# EAGLE schematic main (EAGLE 9.6.2)
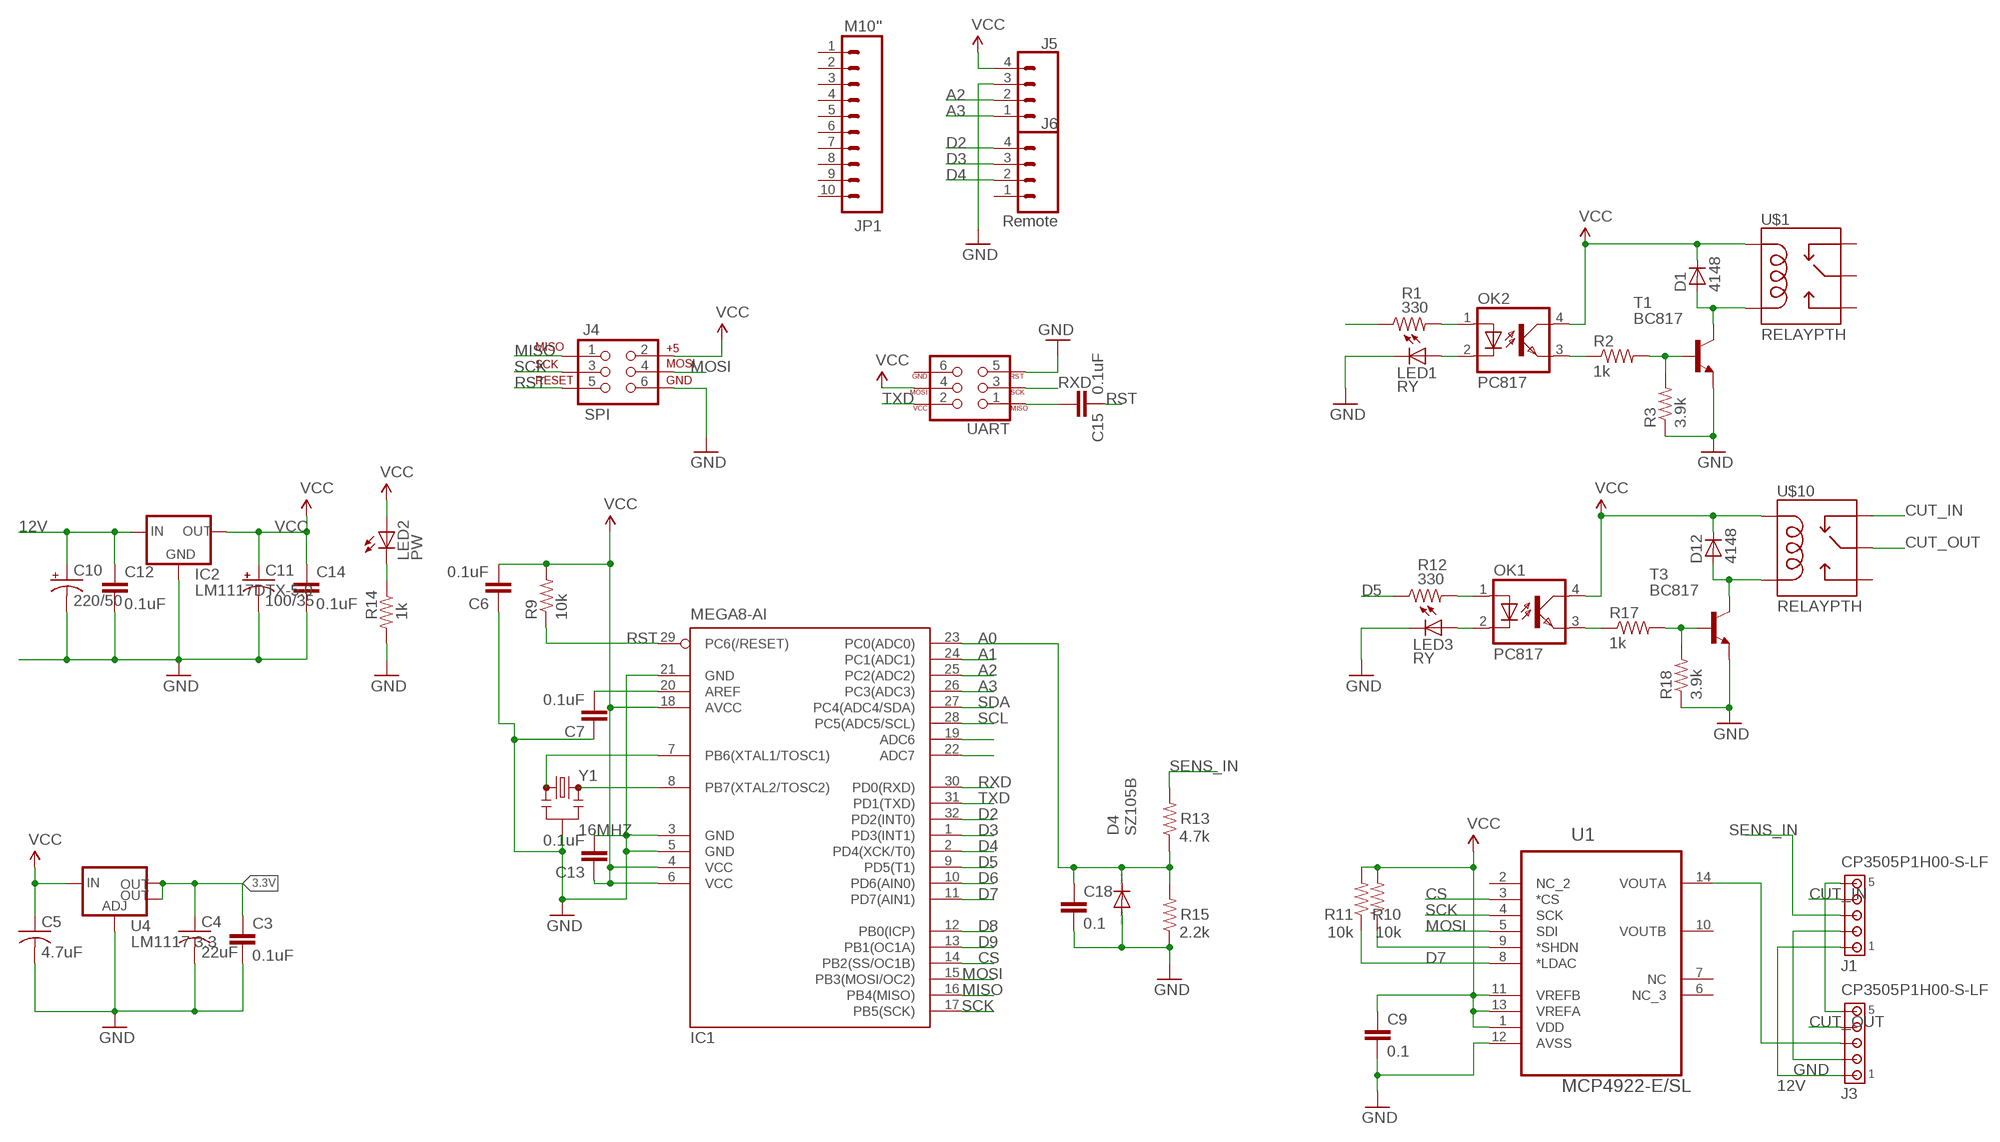
[diagram p0: schematic, sheet 1]

## Parts
C3  0.1uF  CAP0805  [0805]
C4  22uF  C-USC1206  [C1206]
C5  4.7uF  C-USC1206  [C1206]
C6  0.1uF  CAP0805  [0805]
C7  0.1uF  CAP0805  [0805]
C9  0.1  CAP0805  [0805]
C10  220/50  CPOL-US153CLV-1010  [153CLV-1010]
C11  100/35  CPOL-US153CLV-0605  [153CLV-0605]
C12  0.1uF  CAP0805  [0805]
C13  0.1uF  CAP0805  [0805]
C14  0.1uF  CAP0805  [0805]
C15  0.1uF  CAP0805  [0805]
C18  0.1  CAP0805  [0805]
D1  4148  D-SOD-80  [SOD80]
D4  SZ105B  DIODE-DO-214AC  [DO-214AC]
D12  4148  D-SOD-80  [SOD80]
IC1  MEGA8-AI  [TQFP32-08]
IC2  LM1117DTX-5.0  LM1117DTX-3.3  [TO252]
J1  CP3505P1H00-S-LF  1445055-5  [1445055-5]
J3  CP3505P1H00-S-LF  1445055-5  [1445055-5]
J4  SPI  AVR_SPI_PRG_6PTH  [2X3]
J5  CONN_04JST-PTH  [JST-4-PTH]
J6  Remote  CONN_04JST-PTH  [JST-4-PTH]
JP1  M10"  [1X10]
LED1  RY  LED3MM  [LED3MM]
LED2  PW  LED3MM  [LED3MM]
LED3  RY  LED3MM  [LED3MM]
OK1  PC817  LTV816S  [DIL4-SMD]
OK2  PC817  LTV816S  [DIL4-SMD]
R1  330  RESISTOR0805-RES  [0805]
R2  1k  RESISTOR0805-RES  [0805]
R3  3.9k  RESISTOR0805-RES  [0805]
R9  10k  RESISTOR0805-RES  [0805]
R10  10k  RESISTOR0805-RES  [0805]
R11  10k  RESISTOR0805-RES  [0805]
R12  330  RESISTOR0805-RES  [0805]
R13  4.7k  RESISTOR0805-RES  [0805]
R14  1k  RESISTOR0805-RES  [0805]
R15  2.2k  RESISTOR0805-RES  [0805]
R17  1k  RESISTOR0805-RES  [0805]
R18  3.9k  RESISTOR0805-RES  [0805]
T1  BC817  BC817-16-NPN-SOT23-BEC  [SOT23-BEC]
T3  BC817  BC817-16-NPN-SOT23-BEC  [SOT23-BEC]
U1  MCP4922-E/SL  [SOIC127P600X175-14N]
U4  LM1117 3.3  V_REG_LM1117SOT223  [SOT223]
U$1  RELAYPTH  [SRD-05VDC-SL-C]
U$10  RELAYPTH  [SRD-05VDC-SL-C]
UART  AVR_SPI_PROG_3X2TESTPOINTS  [2X3_TEST_POINTS]
Y1  16MHZ  RESONATOR16MHZ  [RESONATOR-SMD]

## Nets
3.3V: C3.1 C4.1 U4.2(OUT) U4.4(OUT)
12V: C10.+ C12.1 IC2.2(IN) J1.1 J3.1
A0: C18.1 D4.C IC1.23(PC0(ADC0)) R13.1 R15.2
A1: IC1.24(PC1(ADC1))
A2: IC1.25(PC2(ADC2)) J5.2
A3: IC1.26(PC3(ADC3)) J5.1
CS: IC1.14(PB2(SS/OC1B)) U1.3(*CS)
CUT_IN: J1.4 U$10.SWCLOSED(SWCLOSE)
CUT_OUT: J3.4 U$10.SWCOMMON
D2: IC1.32(PD2(INT0)) J6.4
D3: IC1.1(PD3(INT1)) J6.3
D4: IC1.2(PD4(XCK/T0)) J6.2
D5: IC1.9(PD5(T1)) R1.1 R12.1
D6: IC1.10(PD6(AIN0))
D7: IC1.11(PD7(AIN1)) R11.1 U1.8(*LDAC)
D8: IC1.12(PB0(ICP))
D9: IC1.13(PB1(OC1A))
GND: C3.2 C4.2 C5.2 C6.1 C7.1 C9.2 C10.- C11.- C12.2 C13.2 C14.2 C18.2 D4.A IC1.3(GND) IC1.5(GND) IC1.21(GND) IC2.1(GND) J1.2 J3.2 J4.6 J5.3 LED1.K(C) LED3.K(C) R3.1 R14.2 R15.1 R18.1 T1.E T3.E U1.12(AVSS) U4.1(ADJ) UART.5 Y1.2
MISO: IC1.16(PB4(MISO)) J4.1
MOSI: IC1.15(PB3(MOSI/OC2)) J4.4 U1.5(SDI)
N$1: IC1.19(ADC6)
N$2: IC1.22(ADC7)
N$3: OK2.3(EMIT) R2.1
N$4: R2.2 R3.2 T1.B
N$5: IC1.8(PB7(XTAL2/TOSC2)) Y1.3
N$6: D1.2(A) T1.C U$1.COIL0
N$7: IC1.7(PB6(XTAL1/TOSC1)) Y1.1
N$8: C7.2 IC1.20(AREF)
N$9: OK2.1(A) R1.2
N$10: LED1.A OK2.2(C)
N$12: LED2.K(C) R14.1
N$13: J3.3 U1.14(VOUTA)
N$14: J1.5 J3.5
N$16: R10.1 U1.9(*SHDN)
N$18: C15.1 UART.1
N$20: OK1.3(EMIT) R17.1
N$21: R17.2 R18.2 T3.B
N$22: D12.2(A) T3.C U$10.COIL0
N$23: OK1.1(A) R12.2
N$31: LED3.A OK1.2(C)
RST: C15.2 IC1.29(PC6(/RESET)) J4.5 R9.1
RXD: IC1.30(PD0(RXD)) UART.3
SCK: IC1.17(PB5(SCK)) J4.3 U1.4(SCK)
SCL: IC1.28(PC5(ADC5/SCL))
SDA: IC1.27(PC4(ADC4/SDA))
SENS_IN: J1.3 R13.2
TXD: IC1.31(PD1(TXD)) UART.2
VCC: C5.1 C6.2 C9.1 C11.+ C13.1 C14.1 D1.1(C) D12.1(C) IC1.4(VCC) IC1.6(VCC) IC1.18(AVCC) IC2.TAB(OUT) J4.2 J5.4 LED2.A OK1.4(COL) OK2.4(COL) R9.2 R10.2 R11.2 U1.1(VDD) U1.11(VREFB) U1.13(VREFA) U4.3(IN) U$1.COIL1 U$10.COIL1 UART.4
Unconnected: J6.1 JP1.1 JP1.2 JP1.3 JP1.4 JP1.5 JP1.6 JP1.7 JP1.8 JP1.9 JP1.10 U1.2(NC_2) U1.6(NC_3) U1.7(NC) U1.10(VOUTB) U$1.SWCLOSED(SWCLOSE) U$1.SWCOMMON U$1.SWOPEN U$10.SWOPEN UART.6

## Library data of the parts
C3 C6 C7 C9 C12-C15 C18 = SparkFun-Passives:CAP: Capacitor Standard 0603 ceramic capacitor, and 0.1" leaded capacitor.
C4 C5 = adafruit:C-US: CAPACITOR, American symbol
C10 C11 = adafruit:CPOL-US: POLARIZED CAPACITOR, American symbol
D1 D12 = semicon-smd-ipc:D-: DIODE unfilled
D4 = diode:DIODE-: DIODE
IC1 = atmel:MEGA8: MICROCONTROLLER 8 Kbytes FLASH, 1 kbytes SRAM, 512 bytes EEPROM, USART, 6-channel 10 bit ADC, 2-channel 8 bit ADC Pin compatible with Atmega48, ATMega88, ATMega168 Source: avr.lbr; MPN: ATMEGA8-16AU; OC_FARNELL: 9171371; OC_NEWARK: 73M8863
IC2 = lm1117:LM1117DTX-*
J1 J3 = con-amp:1445055-5: Micro MATE-N-LOK Connectors grid 1.5 mm Source: ENG_CD_1445055_A.pdf
J4 = SparkFun-Connectors:AVR_SPI_PRG_6: AVR ISP 6 Pin This is the reduced ISP connector for AVR programming. Common on Arduino. This footprint will take up less PCB space and can be used with a 10-pin to 6-pin adapter such as SKU: BOB-08508 **Special note about "TEST_POINT" package. The stop mask is on the top side, so if you want your programming test points to be on the bottom of your board, make sure to place this package on the bottom side of the board. This also ensure that the orientation to program from the bottom side will be correct.
J5 J6 = SparkFun-Connectors:CONN_04: Multi connection point. Often used as Generic Header-pin footprint for 0.1 inch spaced/style header connections On any of the 0.1 inch spaced packages, you can populate with these: Break Away Headers - Straight <https://www.sparkfun.com/products/116> (PRT-00116) Break Away Male Headers - Right Angle <https://www.sparkfun.com/products/553> (PRT-00553) Female Headers <https://www.sparkfun.com/products/115> (PRT-00115) Break Away Headers - Machine Pin <https://www.sparkfun.com/products/117> (PRT-00117) Break Away Female Headers - Swiss Machine Pin <https://www.sparkfun.com/products/743> (PRT-00743) For SCREWTERMINALS and SPRING TERMINALS visit here: Screw Terimnals on SparkFun.com <https://www.sparkfun.com/search/results?term=Screw+Terminals> (5mm/3.5mm/2.54mm spacing) This device is also useful as a general connection point to wire up your design to another part of your project. Our various solder wires solder well into these plated through hole pads. Hook-Up Wire - Assortment (Stranded, 22 AWG) <https://www.sparkfun.com/products/11375> (PRT-11375) Hook-Up Wire - Assortment (Solid Core, 22 AWG) <https://www.sparkfun.com/products/11367> (PRT-11367) View the entire wire category on our website here <https://www.sparkfun.com/categories/141> Special notes: Molex polarized connector foot print use with SKU : PRT-08231 with associated crimp pins and housings. 1MM SMD Version SKU: PRT-10208; PROD_ID: WIRE-13531; SF_ID: PRT-09916
JP1 = SparkFun-Connectors:M10: Header 10 Standard 10-pin 0.1" header. Use with straight break away headers (SKU : PRT-00116), right angle break away headers (PRT-00553), swiss pins (PRT-00743), machine pins (PRT-00117), and female headers (PRT-00115).
LED1-LED3 = adafruit:LED: LED OSRAM: - CHIPLED LG R971, LG N971, LY N971, LG Q971, LY Q971, LO R971, LY R971 LH N974, LH R974 LS Q976, LO Q976, LY Q976 LO Q996 - Hyper CHIPLED LW Q18S LB Q993, LB Q99A, LB R99A - SideLED LS A670, LO A670, LY A670, LG A670, LP A670 LB A673, LV A673, LT A673, LW A673 LH A674 LY A675 LS A676, LA A676, LO A676, LY A676, LW A676 LS A679, LY A679, LG A679 - Hyper Micro SIDELED® LS Y876, LA Y876, LO Y876, LY Y876 LT Y87S - SmartLED LW L88C, LW L88S LB L89C, LB L89S, LG L890 LS L89K, LO L89K, LY L89K LS L896, LA L896, LO L896, LY L896 - TOPLED LS T670, LO T670, LY T670, LG T670, LP T670 LSG T670, LSP T670, LSY T670, LOP T670, LYG T670 LG T671, LOG T671, LSG T671 LB T673, LV T673, LT T673, LW T673 LH T674 LS T676, LA T676, LO T676, LY T676, LB T676, LH T676, LSB T676, LW T676 LB T67C, LV T67C, LT T67C, LS T67K, LO T67K, LY T67K, LW E67C LS E67B, LA E67B, LO E67B, LY E67B, LB E67C, LV E67C, LT E67C LW T67C LS T679, LY T679, LG T679 LS T770, LO T770, LY T770, LG T770, LP T770 LB T773, LV T773, LT T773, LW T773 LH T774 LS E675, LA E675, LY E675, LS T675 LS T776, LA T776, LO T776, LY T776, LB T776 LHGB T686 LT T68C, LB T68C - Hyper Mini TOPLED® LB M676 - Mini TOPLED Santana® LG M470 LS M47K, LO M47K, LY M47K Source: http://www.osram.convergy.de/
OK1 OK2 = optocoupler:LTV816: OPTO COUPLER Source: LITEON, LTV816.pdf
R1-R3 R12 R17 R18 = SparkFun-Passives:RESISTOR: Resistor Basic schematic elements and footprints for 0603, 1206, and PTH resistors.
R9-R11 R13-R15 = SparkFun-Resistors:RESISTOR: Resistor Basic schematic elements and footprints for 0603, 1206, and PTH resistors.
T1 T3 = transistor:*-NPN-: NPN Transistror BF959 corrected 2008.03.06
U1 = Microchip_By_element14_Batch_1:MCP4922-E/SL: IC, 12BIT DAC DUAL, SPI I/F; MPN: MCP4922-E/SL; OC_FARNELL: 1332114; OC_NEWARK: 08J8748; PACKAGE: SOIC14; SUPPLIER: Microchip
U4 = SparkFun-PowerIC:V_REG_LM1117: Voltage Regulator LM1117 Standard adjustable voltage regulator but in SMD form. Spark Fun Electronics SKU : COM-00595; PROD_ID: VREG-08170
U$1 U$10 = SRD-05VDC-SL-C:RELAY: SPDT relay (COM-00101)
UART = SparkFun-Connectors:AVR_SPI_PROG_3X2: AVR ISP 6 Pin This is the reduced ISP connector for AVR programming. Common on Arduino. This footprint will take up less PCB space and can be used with a 10-pin to 6-pin adapter such as SKU: BOB-08508 **Special note about "TEST_POINT" package. The stop mask is on the top side, so if you want your programming test points to be on the bottom of your board, make sure to place this package on the bottom side of the board. This also ensure that the orientation to program from the bottom side will be correct. SparkFun Products: SparkFun ISP Pogo Adapter <https://www.sparkfun.com/products/11591> - NS Tiny AVR Programmer <https://www.sparkfun.com/products/11801> -PTH
Y1 = SparkFun-FreqCtrl:RESONATOR: Resonator Small SMD resonator. Used, eg, on the Arduino Pro/ Pro Mini boards. 8MHz- XTAL-08895 16MHz- XTAL-08900; PROD_ID: XTAL-08900